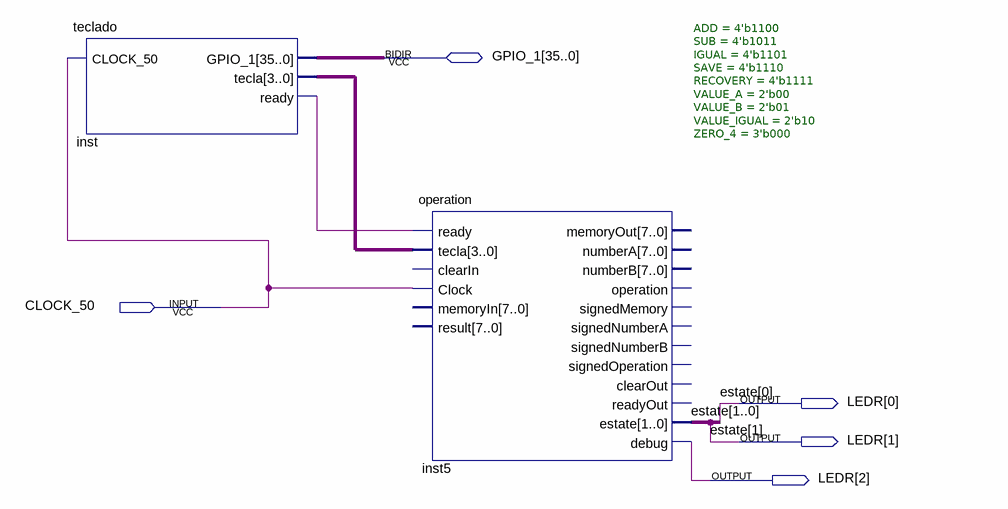
[diagram p0: schematic sheet]
// Quartus schematic teste.bdf as structural Verilog: 2 symbols, 5 pins
module teste (
  input  CLOCK_50,
  inout  [35:0] GPIO_1,
  output [2:0] LEDR
);

  wire inst_ready;
  wire [3:0] inst_tecla;

  teclado inst (.CLOCK_50(CLOCK_50), .tecla(inst_tecla), .ready(inst_ready), .GPIO_1(GPIO_1));
  operation #(.ADD(4'b1100), .SUB(4'b1011), .IGUAL(4'b1101), .SAVE(4'b1110), .RECOVERY(4'b1111), .VALUE_A(2'b00), .VALUE_B(2'b01), .VALUE_IGUAL(2'b10), .ZERO_4(3'b000)) inst5 (
    .ready(inst_ready), .tecla(inst_tecla), .Clock(CLOCK_50), .estate(LEDR[1:0]), .debug(LEDR[2]));  // open: clearIn, memoryIn, result, memoryOut, numberA, numberB, operation, signedMemory, signedNumberA, signedNumberB, signedOperation, clearOut, readyOut

  // Other names for the same wires on the sheet: estate[1:0] = LEDR[1:0]
endmodule
